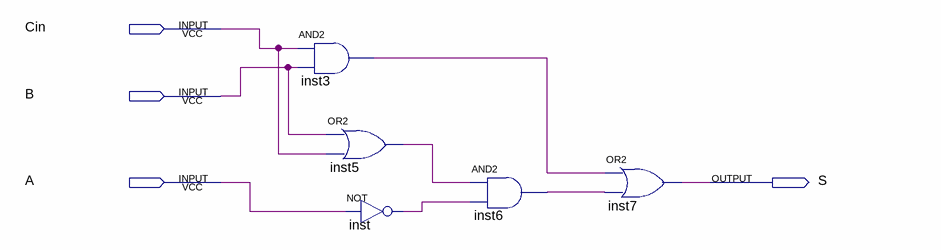
[diagram p0: schematic sheet]
// Quartus schematic maior_bit_mais_significativo.bdf as structural Verilog: 5 symbols, 4 pins
module maior_bit_mais_significativo (
  input  Cin,
  input  B,
  input  A,
  output S
);

  wire inst3_out, inst5_out, inst6_out, inst_out;

  and inst3 (inst3_out, Cin, B);
  or inst5 (inst5_out, B, Cin);
  not inst (inst_out, A);
  and inst6 (inst6_out, inst5_out, inst_out);
  or inst7 (S, inst3_out, inst6_out);
endmodule
